# EAGLE schematic audioplayer (EAGLE 5.07)
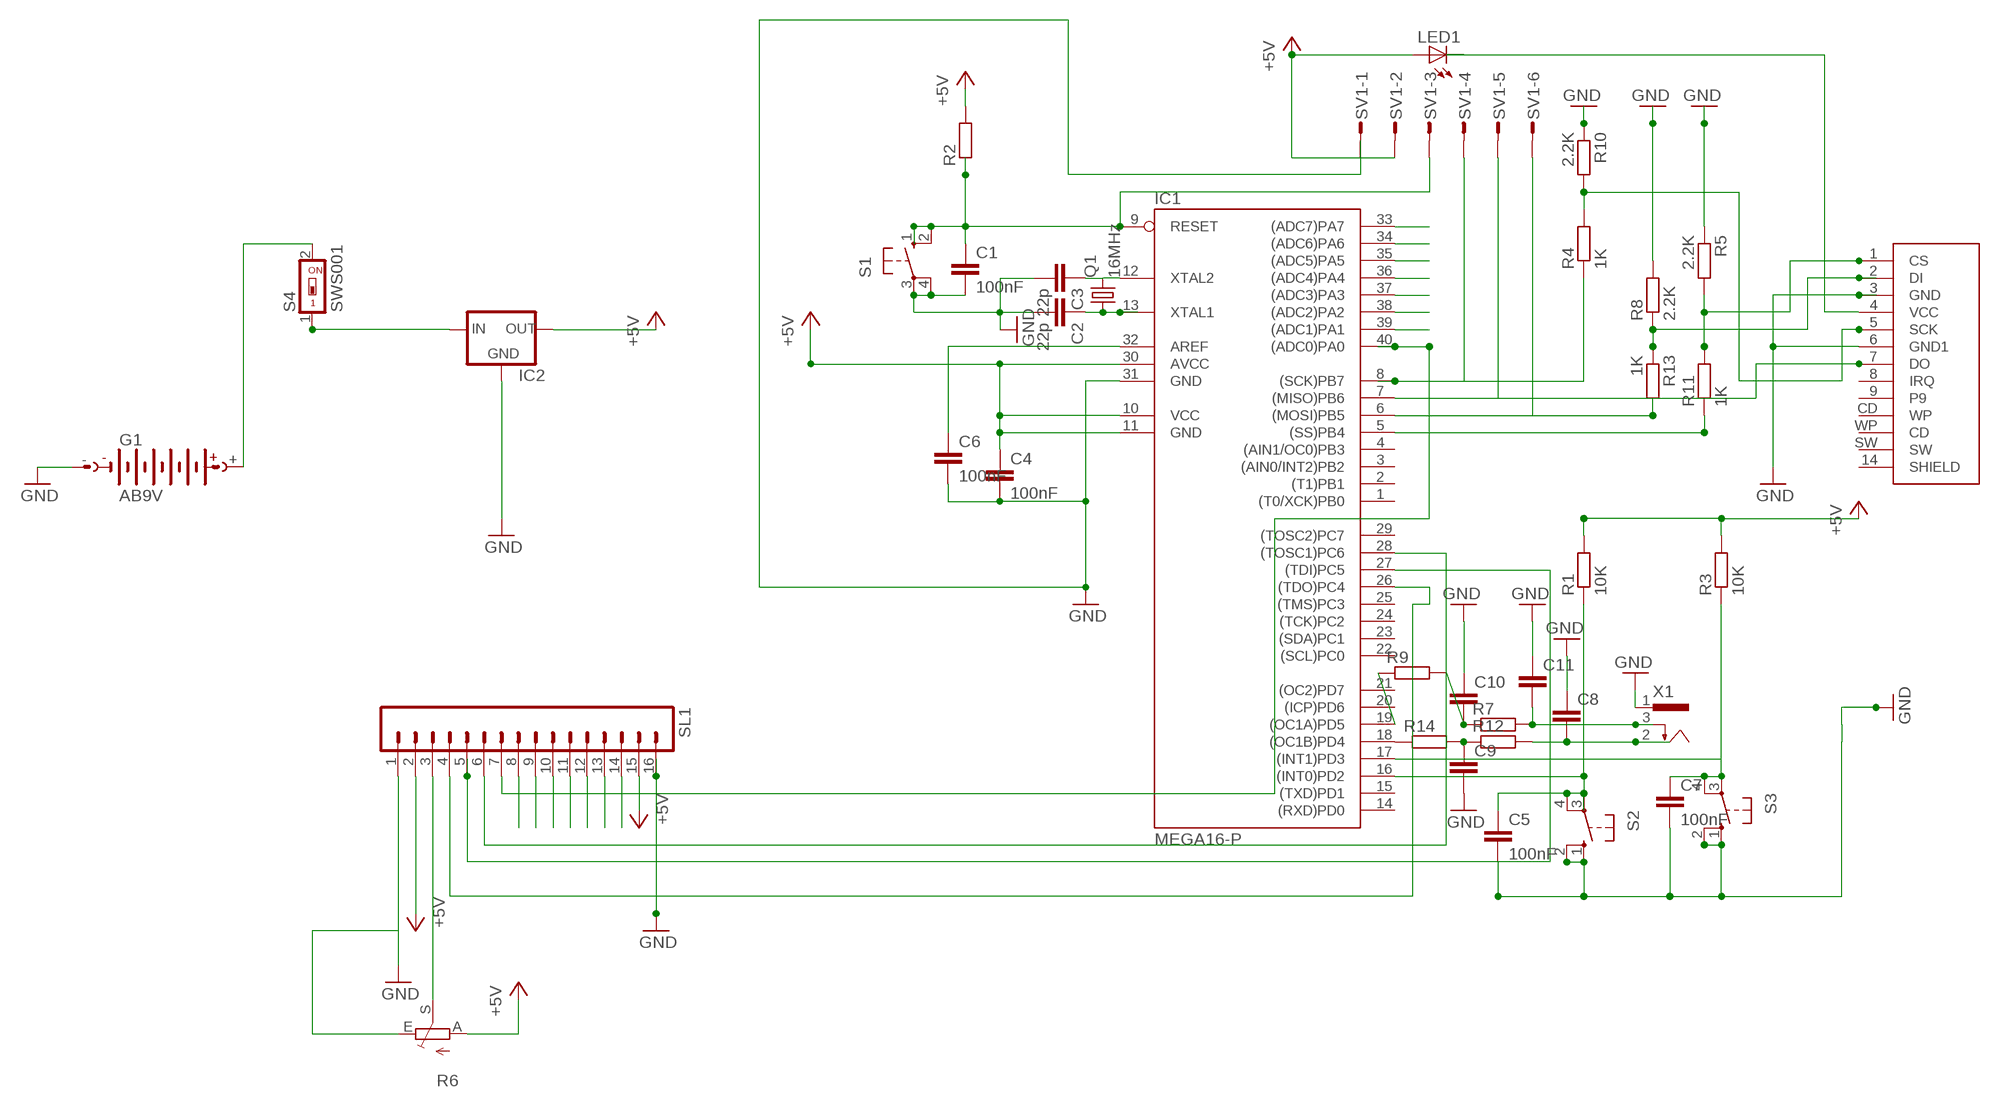
[diagram p0: schematic, sheet 1]

## Parts
C1  100nF  C-EUC1206  [C1206]
C2  22p  C-EUC1206  [C1206]
C3  22p  C-EUC1206  [C1206]
C4  100nF  C-EUC1206  [C1206]
C5  100nF  C-EUC1206  [C1206]
C6  100nF  C-EUC1206  [C1206]
C7  100nF  C-EUC1206  [C1206]
C8  C-EUC1206  [C1206]
C9  C-EUC1206  [C1206]
C10  C-EUC1206  [C1206]
C11  C-EUC1206  [C1206]
G1  AB9V  [AB9V]
IC1  MEGA16-P  [DIL40]
IC2  78XXS  [78XXS]
LED1  LEDCHIPLED_1206  [CHIPLED_1206]
Q1  16MHz  CRYSTALHC49S  [HC49/S]
R1  10K  R-EU_M1206  [M1206]
R2  R-EU_M1206  [M1206]
R3  10K  R-EU_M1206  [M1206]
R4  1K  R-EU_M1206  [M1206]
R5  2.2K  R-EU_M1206  [M1206]
R6  TRIM_EU-B64Y  [B64Y]
R7  R-EU_M1206  [M1206]
R8  2.2K  R-EU_M1206  [M1206]
R9  R-EU_M1206  [M1206]
R10  2.2K  R-EU_M1206  [M1206]
R11  1K  R-EU_M1206  [M1206]
R12  R-EU_M1206  [M1206]
R13  1K  R-EU_M1206  [M1206]
R14  R-EU_M1206  [M1206]
S1  10-XX  [B3F-10XX]
S2  10-XX  [B3F-10XX]
S3  10-XX  [B3F-10XX]
S4  SWS001  [SMS-001]
SL1  MA16  [16PA]
SV1  S06P  [S06P]
U$1  SD_CARD_SOCKETSD  [SD-MMC_SOCKET-PP]
X1  SCD-014A  [SCD-014-A]

## Nets
+5V: C4.1 IC1.10(VCC) IC1.11(GND) IC1.30(AVCC) IC2.OUT LED1.A R1.2 R2.2 R3.2 R6.A SL1.2 SL1.15 SV1.2
GND: C1.2 C2.2 C3.2 C4.2 C5.2 C6.2 C7.2 C8.1 C9.2 C10.1 C11.1 G1.- IC1.31(GND) IC2.GND R5.1 R6.E R8.2 R10.1 S1.3(P) S1.4(P1) S2.1(S) S2.2(S1) S3.1(S) S3.2(S1) SL1.1 SL1.16 U$1.3(GND) U$1.6(GND1) X1.1
N$2: C11.2 R7.2 X1.3
N$3: IC1.18((OC1B)PD4) R14.1
N$4: IC1.8((SCK)PB7) R4.1 SV1.4
N$5: G1.+ S4.2
N$7: R6.S SL1.3
N$8: C1.1 IC1.9(RESET) R2.1 S1.1(S) S1.2(S1) SV1.3
N$9: C2.1 IC1.13(XTAL1) Q1.1
N$10: C9.1 R12.1 R14.2
N$11: C6.1 IC1.32(AREF)
N$12: IC1.19((OC1A)PD5) R9.1
N$13: C10.2 R7.1 R9.2
N$14: C5.1 IC1.16((INT0)PD2) R1.1 S2.3(P) S2.4(P1)
N$15: U$1.4(VCC)
N$16: C8.2 R12.2 X1.2
N$17: C7.1 IC1.17((INT1)PD3) R3.1 S3.3(P) S3.4(P1)
N$19: R4.2 R10.2 U$1.5(SCK)
N$20: IC2.IN S4.1
N$21: R5.2 R11.2 U$1.1(CS)
N$22: C3.1 IC1.12(XTAL2) Q1.2
N$23: R8.1 R13.1 U$1.2(DI)
N$24: IC1.7((MISO)PB6) SV1.5 U$1.7(DO)
N$26: IC1.6((MOSI)PB5) R13.2 SV1.6
N$27: IC1.5((SS)PB4) R11.1
PA0: IC1.40((ADC0)PA0) SL1.7
PA1: IC1.39((ADC1)PA1) SL1.8
PA2: IC1.38((ADC2)PA2) SL1.9
PA3: IC1.37((ADC3)PA3) SL1.10
PA4: IC1.36((ADC4)PA4) SL1.11
PA5: IC1.35((ADC5)PA5) SL1.12
PA6: IC1.34((ADC6)PA6) SL1.13
PA7: IC1.33((ADC7)PA7) SL1.14
PC4: IC1.26((TDO)PC4) SL1.4
PC5: IC1.27((TDI)PC5) SL1.5
PC6: IC1.28((TOSC1)PC6) SL1.6
Unconnected: IC1.1((T0/XCK)PB0) IC1.2((T1)PB1) IC1.3((AIN0/INT2)PB2) IC1.4((AIN1/OC0)PB3) IC1.14((RXD)PD0) IC1.15((TXD)PD1) IC1.20((ICP)PD6) IC1.21((OC2)PD7) IC1.22((SCL)PC0) IC1.23((SDA)PC1) IC1.24((TCK)PC2) IC1.25((TMS)PC3) IC1.29((TOSC2)PC7) LED1.C SV1.1 U$1.8(IRQ) U$1.9 U$1.14(SHIELD) U$1.CD(WP) U$1.SW U$1.WP(CD)

## Library data of the parts
C1-C11 = rcl:C-EU: CAPACITOR, European symbol
G1 = battery:AB9V: 9-V BATTERY CLIP
IC1 = atmel:MEGA16-P: MICROCONTROLLER 16 Kbytes FLASH 1 kbytes SRAM 512 bytes EEPROM USART 8-channel 10 bit ADC Source: avr.lbr
IC2 = v-reg:78XXS: VOLTAGE REGULATOR
LED1 = led:LED: LED OSRAM: - CHIPLED LG R971, LG N971, LY N971, LG Q971, LY Q971, LO R971, LY R971 LH N974, LH R974 LS Q976, LO Q976, LY Q976 LO Q996 - Hyper CHIPLED LW Q18S LB Q993, LB Q99A, LB R99A - SideLED LS A670, LO A670, LY A670, LG A670, LP A670 LB A673, LV A673, LT A673, LW A673 LH A674 LY A675 LS A676, LA A676, LO A676, LY A676, LW A676 LS A679, LY A679, LG A679 - Hyper Micro SIDELED® LS Y876, LA Y876, LO Y876, LY Y876 LT Y87S - SmartLED LW L88C, LW L88S LB L89C, LB L89S, LG L890 LS L89K, LO L89K, LY L89K LS L896, LA L896, LO L896, LY L896 - TOPLED LS T670, LO T670, LY T670, LG T670, LP T670 LSG T670, LSP T670, LSY T670, LOP T670, LYG T670 LG T671, LOG T671, LSG T671 LB T673, LV T673, LT T673, LW T673 LH T674 LS T676, LA T676, LO T676, LY T676, LB T676, LH T676, LSB T676, LW T676 LB T67C, LV T67C, LT T67C, LS T67K, LO T67K, LY T67K, LW E67C LS E67B, LA E67B, LO E67B, LY E67B, LB E67C, LV E67C, LT E67C LW T67C LS T679, LY T679, LG T679 LS T770, LO T770, LY T770, LG T770, LP T770 LB T773, LV T773, LT T773, LW T773 LH T774 LS E675, LA E675, LY E675, LS T675 LS T776, LA T776, LO T776, LY T776, LB T776 LHGB T686 LT T68C, LB T68C - Hyper Mini TOPLED® LB M676 - Mini TOPLED Santana® LG M470 LS M47K, LO M47K, LY M47K Source: http://www.osram.convergy.de LUXEON: - LUMILED® LXK2-PW12-R00, LXK2-PW12-S00, LXK2-PW14-U00, LXK2-PW14-V00 LXK2-PM12-R00, LXK2-PM12-S00, LXK2-PM14-U00 LXK2-PE12-Q00, LXK2-PE12-R00, LXK2-PE12-S00, LXK2-PE14-T00, LXK2-PE14-U00 LXK2-PB12-K00, LXK2-PB12-L00, LXK2-PB12-M00, LXK2-PB14-N00, LXK2-PB14-P00, LXK2-PB14-Q00 LXK2-PR12-L00, LXK2-PR12-M00, LXK2-PR14-Q00, LXK2-PR14-R00 LXK2-PD12-Q00, LXK2-PD12-R00, LXK2-PD12-S00 LXK2-PH12-R00, LXK2-PH12-S00 LXK2-PL12-P00, LXK2-PL12-Q00, LXK2-PL12-R00 Source: www.luxeon.com KINGBRIGHT: KA-3528ASYC Source: www.kingbright.com
Q1 = crystal:CRYSTAL: CRYSTAL
R1-R5 R7-R14 = rcl:R-EU_: RESISTOR, European symbol
R6 = pot:TRIM_EU-: POTENTIOMETER
S1-S3 = switch-omron:10-XX: OMRON SWITCH
S4 = smd-special:SWS001: SMD Dip Switch 1 pol.
SL1 = con-amp-quick:MA16: AMP QUICK CONNECTOR
SV1 = con-amp-mt:S06P: AMP MT CONNECTOR
U$1 = SparkFun:SD_CARD_SOCKET: SD/MMC Socket Media socket for SD and MMC cards. Push-push type. Schematic element and footprint production proven. Spark Fun Electronics SKU : PRT-00136
X1 = con-shiua-chyuan:SCD-014A: Power Jack 2.5mm